# EAGLE design cnn_card (EAGLE 9.7.0)
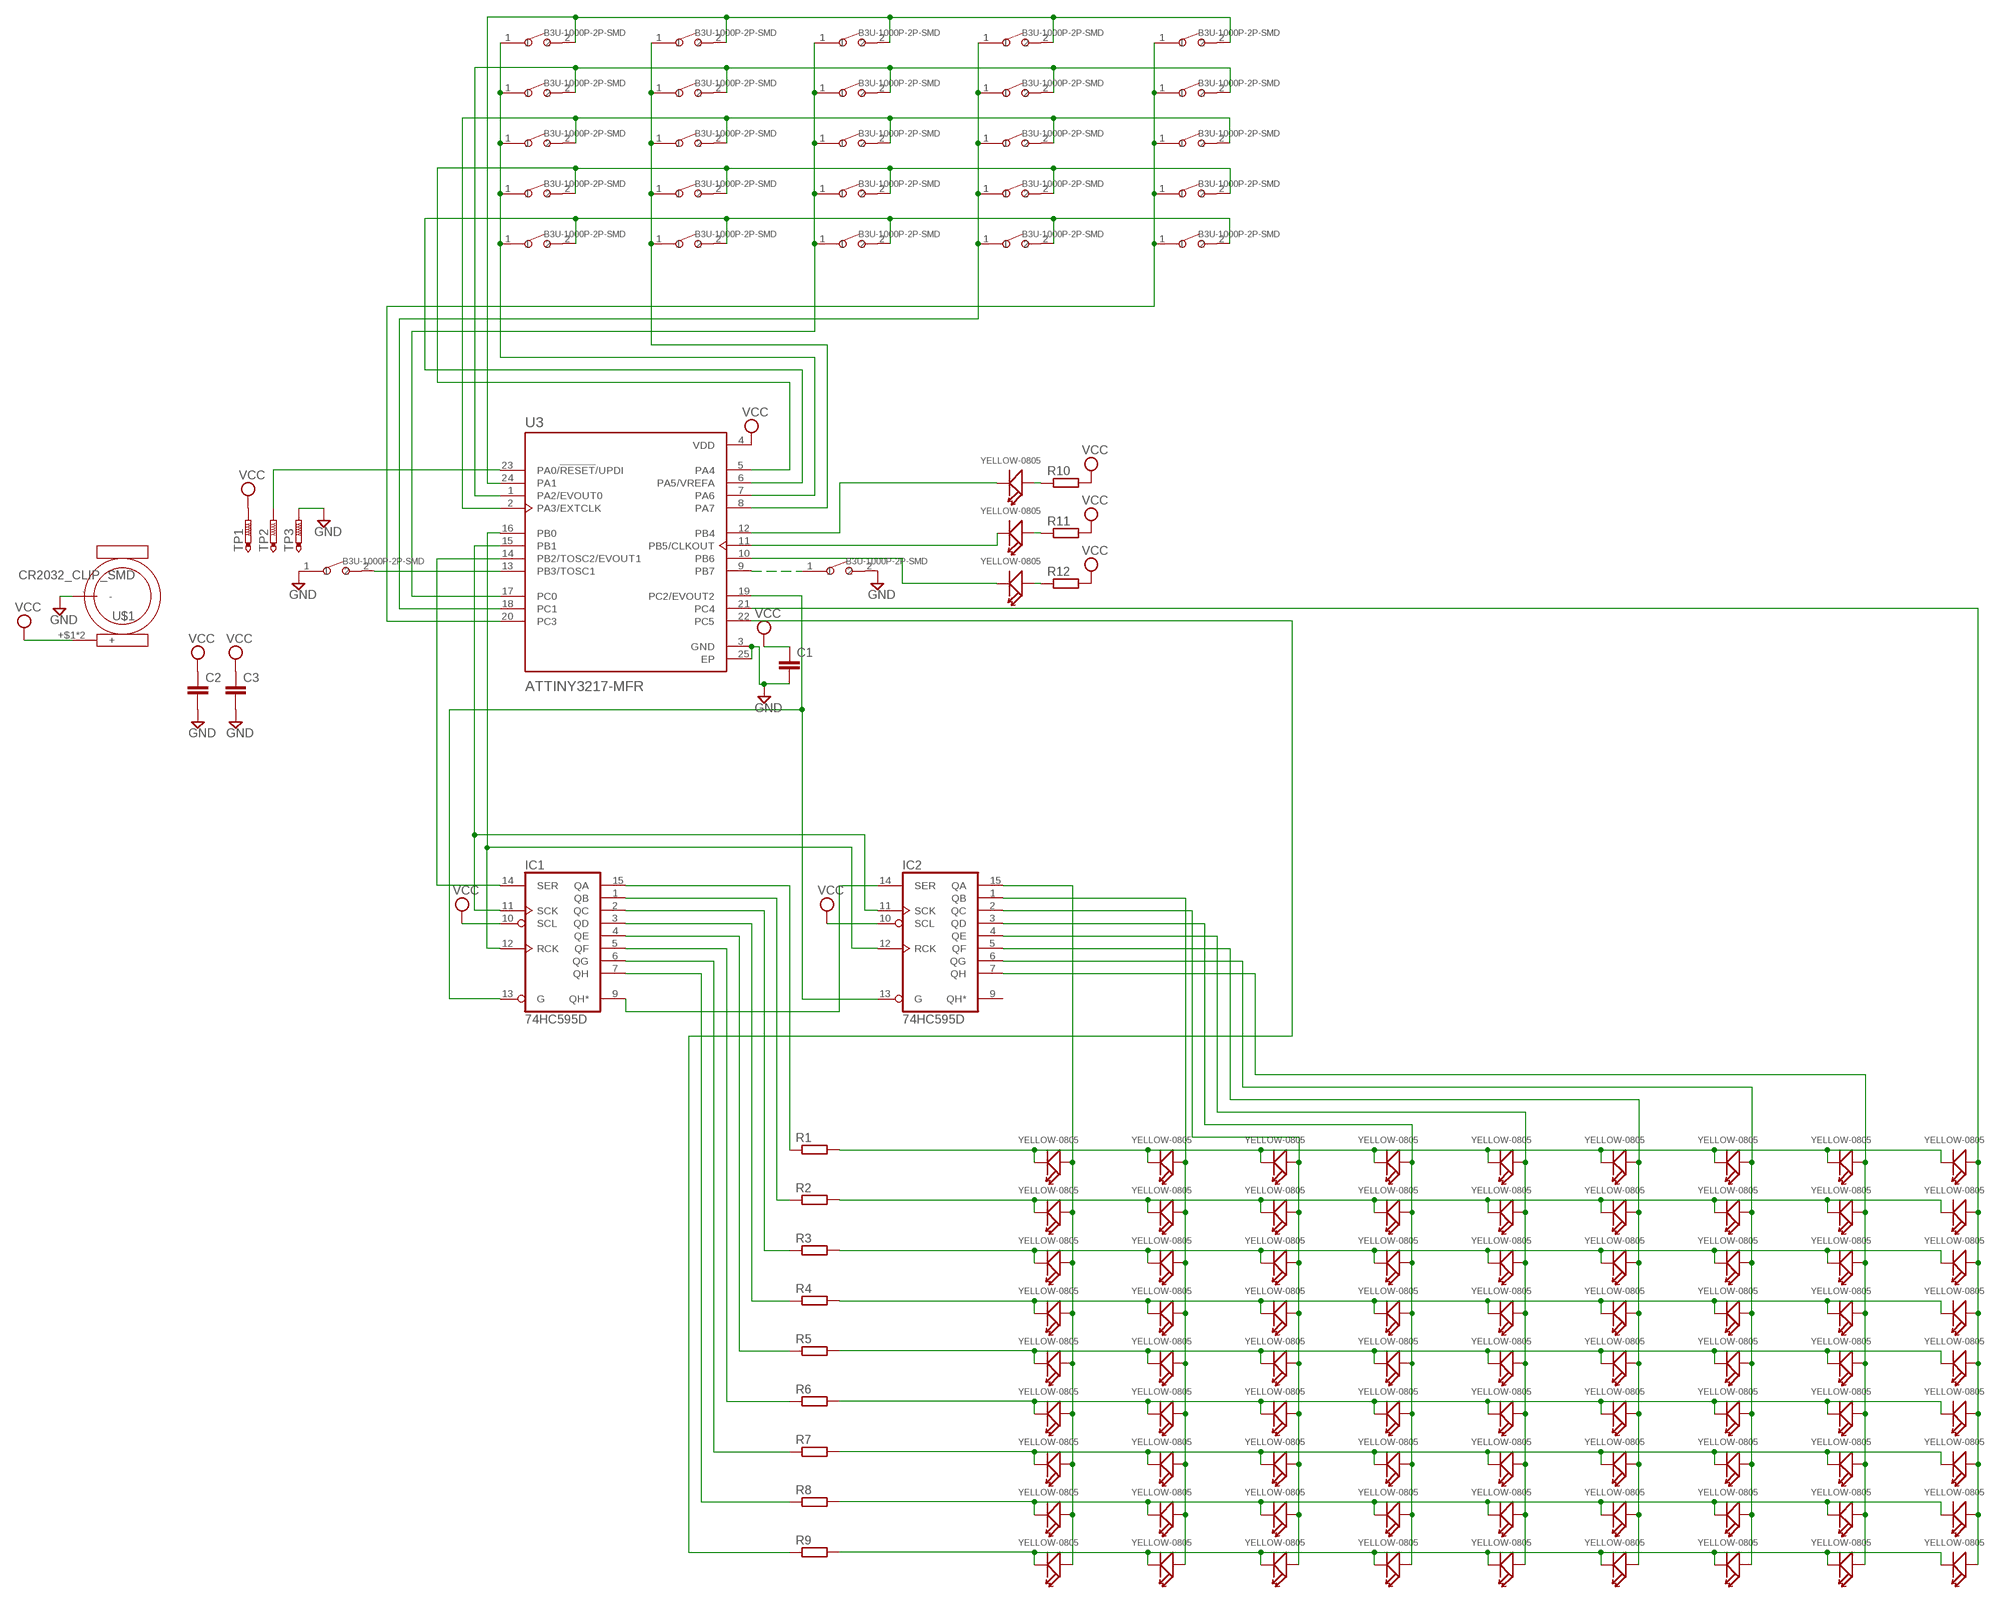
[diagram p0: schematic, sheet 1]

## Parts
C1  C-EUC0805  [C0805]
C2  C-EUC0805  [C0805]
C3  C-EUC0805  [C0805]
D1  YELLOW-0805  SMD-LED-CLEAR-YELLOW(0805)  [LED-0805]
D2  YELLOW-0805  SMD-LED-CLEAR-YELLOW(0805)  [LED-0805]
D3  YELLOW-0805  SMD-LED-CLEAR-YELLOW(0805)  [LED-0805]
D4  YELLOW-0805  SMD-LED-CLEAR-YELLOW(0805)  [LED-0805]
D5  YELLOW-0805  SMD-LED-CLEAR-YELLOW(0805)  [LED-0805]
D6  YELLOW-0805  SMD-LED-CLEAR-YELLOW(0805)  [LED-0805]
D7  YELLOW-0805  SMD-LED-CLEAR-YELLOW(0805)  [LED-0805]
D8  YELLOW-0805  SMD-LED-CLEAR-YELLOW(0805)  [LED-0805]
D9  YELLOW-0805  SMD-LED-CLEAR-YELLOW(0805)  [LED-0805]
D10  YELLOW-0805  SMD-LED-CLEAR-YELLOW(0805)  [LED-0805]
D11  YELLOW-0805  SMD-LED-CLEAR-YELLOW(0805)  [LED-0805]
D12  YELLOW-0805  SMD-LED-CLEAR-YELLOW(0805)  [LED-0805]
D13  YELLOW-0805  SMD-LED-CLEAR-YELLOW(0805)  [LED-0805]
D14  YELLOW-0805  SMD-LED-CLEAR-YELLOW(0805)  [LED-0805]
D15  YELLOW-0805  SMD-LED-CLEAR-YELLOW(0805)  [LED-0805]
D16  YELLOW-0805  SMD-LED-CLEAR-YELLOW(0805)  [LED-0805]
D17  YELLOW-0805  SMD-LED-CLEAR-YELLOW(0805)  [LED-0805]
D18  YELLOW-0805  SMD-LED-CLEAR-YELLOW(0805)  [LED-0805]
D19  YELLOW-0805  SMD-LED-CLEAR-YELLOW(0805)  [LED-0805]
D20  YELLOW-0805  SMD-LED-CLEAR-YELLOW(0805)  [LED-0805]
D21  YELLOW-0805  SMD-LED-CLEAR-YELLOW(0805)  [LED-0805]
D22  YELLOW-0805  SMD-LED-CLEAR-YELLOW(0805)  [LED-0805]
D23  YELLOW-0805  SMD-LED-CLEAR-YELLOW(0805)  [LED-0805]
D24  YELLOW-0805  SMD-LED-CLEAR-YELLOW(0805)  [LED-0805]
D25  YELLOW-0805  SMD-LED-CLEAR-YELLOW(0805)  [LED-0805]
D26  YELLOW-0805  SMD-LED-CLEAR-YELLOW(0805)  [LED-0805]
D27  YELLOW-0805  SMD-LED-CLEAR-YELLOW(0805)  [LED-0805]
D28  YELLOW-0805  SMD-LED-CLEAR-YELLOW(0805)  [LED-0805]
D29  YELLOW-0805  SMD-LED-CLEAR-YELLOW(0805)  [LED-0805]
D30  YELLOW-0805  SMD-LED-CLEAR-YELLOW(0805)  [LED-0805]
D31  YELLOW-0805  SMD-LED-CLEAR-YELLOW(0805)  [LED-0805]
D32  YELLOW-0805  SMD-LED-CLEAR-YELLOW(0805)  [LED-0805]
D33  YELLOW-0805  SMD-LED-CLEAR-YELLOW(0805)  [LED-0805]
D34  YELLOW-0805  SMD-LED-CLEAR-YELLOW(0805)  [LED-0805]
D35  YELLOW-0805  SMD-LED-CLEAR-YELLOW(0805)  [LED-0805]
D36  YELLOW-0805  SMD-LED-CLEAR-YELLOW(0805)  [LED-0805]
D37  YELLOW-0805  SMD-LED-CLEAR-YELLOW(0805)  [LED-0805]
D38  YELLOW-0805  SMD-LED-CLEAR-YELLOW(0805)  [LED-0805]
D39  YELLOW-0805  SMD-LED-CLEAR-YELLOW(0805)  [LED-0805]
D40  YELLOW-0805  SMD-LED-CLEAR-YELLOW(0805)  [LED-0805]
D41  YELLOW-0805  SMD-LED-CLEAR-YELLOW(0805)  [LED-0805]
D42  YELLOW-0805  SMD-LED-CLEAR-YELLOW(0805)  [LED-0805]
D43  YELLOW-0805  SMD-LED-CLEAR-YELLOW(0805)  [LED-0805]
D44  YELLOW-0805  SMD-LED-CLEAR-YELLOW(0805)  [LED-0805]
D45  YELLOW-0805  SMD-LED-CLEAR-YELLOW(0805)  [LED-0805]
D46  YELLOW-0805  SMD-LED-CLEAR-YELLOW(0805)  [LED-0805]
D47  YELLOW-0805  SMD-LED-CLEAR-YELLOW(0805)  [LED-0805]
D48  YELLOW-0805  SMD-LED-CLEAR-YELLOW(0805)  [LED-0805]
D49  YELLOW-0805  SMD-LED-CLEAR-YELLOW(0805)  [LED-0805]
D50  YELLOW-0805  SMD-LED-CLEAR-YELLOW(0805)  [LED-0805]
D51  YELLOW-0805  SMD-LED-CLEAR-YELLOW(0805)  [LED-0805]
D52  YELLOW-0805  SMD-LED-CLEAR-YELLOW(0805)  [LED-0805]
D53  YELLOW-0805  SMD-LED-CLEAR-YELLOW(0805)  [LED-0805]
D54  YELLOW-0805  SMD-LED-CLEAR-YELLOW(0805)  [LED-0805]
D55  YELLOW-0805  SMD-LED-CLEAR-YELLOW(0805)  [LED-0805]
D56  YELLOW-0805  SMD-LED-CLEAR-YELLOW(0805)  [LED-0805]
D57  YELLOW-0805  SMD-LED-CLEAR-YELLOW(0805)  [LED-0805]
D61  YELLOW-0805  SMD-LED-CLEAR-YELLOW(0805)  [LED-0805]
D62  YELLOW-0805  SMD-LED-CLEAR-YELLOW(0805)  [LED-0805]
D63  YELLOW-0805  SMD-LED-CLEAR-YELLOW(0805)  [LED-0805]
D64  YELLOW-0805  SMD-LED-CLEAR-YELLOW(0805)  [LED-0805]
D65  YELLOW-0805  SMD-LED-CLEAR-YELLOW(0805)  [LED-0805]
D66  YELLOW-0805  SMD-LED-CLEAR-YELLOW(0805)  [LED-0805]
D67  YELLOW-0805  SMD-LED-CLEAR-YELLOW(0805)  [LED-0805]
D68  YELLOW-0805  SMD-LED-CLEAR-YELLOW(0805)  [LED-0805]
D69  YELLOW-0805  SMD-LED-CLEAR-YELLOW(0805)  [LED-0805]
D71  YELLOW-0805  SMD-LED-CLEAR-YELLOW(0805)  [LED-0805]
D72  YELLOW-0805  SMD-LED-CLEAR-YELLOW(0805)  [LED-0805]
D73  YELLOW-0805  SMD-LED-CLEAR-YELLOW(0805)  [LED-0805]
D74  YELLOW-0805  SMD-LED-CLEAR-YELLOW(0805)  [LED-0805]
D75  YELLOW-0805  SMD-LED-CLEAR-YELLOW(0805)  [LED-0805]
D76  YELLOW-0805  SMD-LED-CLEAR-YELLOW(0805)  [LED-0805]
D77  YELLOW-0805  SMD-LED-CLEAR-YELLOW(0805)  [LED-0805]
D78  YELLOW-0805  SMD-LED-CLEAR-YELLOW(0805)  [LED-0805]
D79  YELLOW-0805  SMD-LED-CLEAR-YELLOW(0805)  [LED-0805]
D81  YELLOW-0805  SMD-LED-CLEAR-YELLOW(0805)  [LED-0805]
D82  YELLOW-0805  SMD-LED-CLEAR-YELLOW(0805)  [LED-0805]
D83  YELLOW-0805  SMD-LED-CLEAR-YELLOW(0805)  [LED-0805]
D84  YELLOW-0805  SMD-LED-CLEAR-YELLOW(0805)  [LED-0805]
D85  YELLOW-0805  SMD-LED-CLEAR-YELLOW(0805)  [LED-0805]
D86  YELLOW-0805  SMD-LED-CLEAR-YELLOW(0805)  [LED-0805]
D87  YELLOW-0805  SMD-LED-CLEAR-YELLOW(0805)  [LED-0805]
D88  YELLOW-0805  SMD-LED-CLEAR-YELLOW(0805)  [LED-0805]
D89  YELLOW-0805  SMD-LED-CLEAR-YELLOW(0805)  [LED-0805]
FILTER_SW  B3U-1000P-2P-SMD  SMD-BUTTON(2P-3.0X2.5X1.2+0.4MM)-B3U-1000P-2P-SMD  [SW2-2.6-3.0X2.5X1.2+0.4MM]
IC1  74HC595D  [SO16]
IC2  74HC595D  [SO16]
PWR_SW  B3U-1000P-2P-SMD  SMD-BUTTON(2P-3.0X2.5X1.2+0.4MM)-B3U-1000P-2P-SMD  [SW2-2.6-3.0X2.5X1.2+0.4MM]
R1  R-EU_R0805  [R0805]
R2  R-EU_R0805  [R0805]
R3  R-EU_R0805  [R0805]
R4  R-EU_R0805  [R0805]
R5  R-EU_R0805  [R0805]
R6  R-EU_R0805  [R0805]
R7  R-EU_R0805  [R0805]
R8  R-EU_R0805  [R0805]
R9  R-EU_R0805  [R0805]
R10  R-EU_R0805  [R0805]
R11  R-EU_R0805  [R0805]
R12  R-EU_R0805  [R0805]
SW1  B3U-1000P-2P-SMD  SMD-BUTTON(2P-3.0X2.5X1.2+0.4MM)-B3U-1000P-2P-SMD  [SW2-2.6-3.0X2.5X1.2+0.4MM]
SW2  B3U-1000P-2P-SMD  SMD-BUTTON(2P-3.0X2.5X1.2+0.4MM)-B3U-1000P-2P-SMD  [SW2-2.6-3.0X2.5X1.2+0.4MM]
SW3  B3U-1000P-2P-SMD  SMD-BUTTON(2P-3.0X2.5X1.2+0.4MM)-B3U-1000P-2P-SMD  [SW2-2.6-3.0X2.5X1.2+0.4MM]
SW4  B3U-1000P-2P-SMD  SMD-BUTTON(2P-3.0X2.5X1.2+0.4MM)-B3U-1000P-2P-SMD  [SW2-2.6-3.0X2.5X1.2+0.4MM]
SW5  B3U-1000P-2P-SMD  SMD-BUTTON(2P-3.0X2.5X1.2+0.4MM)-B3U-1000P-2P-SMD  [SW2-2.6-3.0X2.5X1.2+0.4MM]
SW6  B3U-1000P-2P-SMD  SMD-BUTTON(2P-3.0X2.5X1.2+0.4MM)-B3U-1000P-2P-SMD  [SW2-2.6-3.0X2.5X1.2+0.4MM]
SW7  B3U-1000P-2P-SMD  SMD-BUTTON(2P-3.0X2.5X1.2+0.4MM)-B3U-1000P-2P-SMD  [SW2-2.6-3.0X2.5X1.2+0.4MM]
SW8  B3U-1000P-2P-SMD  SMD-BUTTON(2P-3.0X2.5X1.2+0.4MM)-B3U-1000P-2P-SMD  [SW2-2.6-3.0X2.5X1.2+0.4MM]
SW9  B3U-1000P-2P-SMD  SMD-BUTTON(2P-3.0X2.5X1.2+0.4MM)-B3U-1000P-2P-SMD  [SW2-2.6-3.0X2.5X1.2+0.4MM]
SW10  B3U-1000P-2P-SMD  SMD-BUTTON(2P-3.0X2.5X1.2+0.4MM)-B3U-1000P-2P-SMD  [SW2-2.6-3.0X2.5X1.2+0.4MM]
SW11  B3U-1000P-2P-SMD  SMD-BUTTON(2P-3.0X2.5X1.2+0.4MM)-B3U-1000P-2P-SMD  [SW2-2.6-3.0X2.5X1.2+0.4MM]
SW12  B3U-1000P-2P-SMD  SMD-BUTTON(2P-3.0X2.5X1.2+0.4MM)-B3U-1000P-2P-SMD  [SW2-2.6-3.0X2.5X1.2+0.4MM]
SW13  B3U-1000P-2P-SMD  SMD-BUTTON(2P-3.0X2.5X1.2+0.4MM)-B3U-1000P-2P-SMD  [SW2-2.6-3.0X2.5X1.2+0.4MM]
SW14  B3U-1000P-2P-SMD  SMD-BUTTON(2P-3.0X2.5X1.2+0.4MM)-B3U-1000P-2P-SMD  [SW2-2.6-3.0X2.5X1.2+0.4MM]
SW15  B3U-1000P-2P-SMD  SMD-BUTTON(2P-3.0X2.5X1.2+0.4MM)-B3U-1000P-2P-SMD  [SW2-2.6-3.0X2.5X1.2+0.4MM]
SW16  B3U-1000P-2P-SMD  SMD-BUTTON(2P-3.0X2.5X1.2+0.4MM)-B3U-1000P-2P-SMD  [SW2-2.6-3.0X2.5X1.2+0.4MM]
SW17  B3U-1000P-2P-SMD  SMD-BUTTON(2P-3.0X2.5X1.2+0.4MM)-B3U-1000P-2P-SMD  [SW2-2.6-3.0X2.5X1.2+0.4MM]
SW18  B3U-1000P-2P-SMD  SMD-BUTTON(2P-3.0X2.5X1.2+0.4MM)-B3U-1000P-2P-SMD  [SW2-2.6-3.0X2.5X1.2+0.4MM]
SW19  B3U-1000P-2P-SMD  SMD-BUTTON(2P-3.0X2.5X1.2+0.4MM)-B3U-1000P-2P-SMD  [SW2-2.6-3.0X2.5X1.2+0.4MM]
SW20  B3U-1000P-2P-SMD  SMD-BUTTON(2P-3.0X2.5X1.2+0.4MM)-B3U-1000P-2P-SMD  [SW2-2.6-3.0X2.5X1.2+0.4MM]
SW21  B3U-1000P-2P-SMD  SMD-BUTTON(2P-3.0X2.5X1.2+0.4MM)-B3U-1000P-2P-SMD  [SW2-2.6-3.0X2.5X1.2+0.4MM]
SW22  B3U-1000P-2P-SMD  SMD-BUTTON(2P-3.0X2.5X1.2+0.4MM)-B3U-1000P-2P-SMD  [SW2-2.6-3.0X2.5X1.2+0.4MM]
SW23  B3U-1000P-2P-SMD  SMD-BUTTON(2P-3.0X2.5X1.2+0.4MM)-B3U-1000P-2P-SMD  [SW2-2.6-3.0X2.5X1.2+0.4MM]
SW24  B3U-1000P-2P-SMD  SMD-BUTTON(2P-3.0X2.5X1.2+0.4MM)-B3U-1000P-2P-SMD  [SW2-2.6-3.0X2.5X1.2+0.4MM]
SW25  B3U-1000P-2P-SMD  SMD-BUTTON(2P-3.0X2.5X1.2+0.4MM)-B3U-1000P-2P-SMD  [SW2-2.6-3.0X2.5X1.2+0.4MM]
TP1  PTR1TP15R  [TP15R]
TP2  PTR1TP15R  [TP15R]
TP3  PTR1TP15R  [TP15R]
U3  ATTINY3217-MFR  [QFN50P400X400X90-25N]
U$1  CR2032_CLIP_SMD  [CR2032_SMT_BAT-HLD-001]

## Nets
GND: C1.2 C2.2 C3.2 FILTER_SW.2 PWR_SW.1 TP3.TP U3.3(GND) U3.25(EP) U$1.-
N$1: D55.- U3.12(PB4)
N$2: D56.- U3.11(PB5/CLKOUT)
N$3: D57.- U3.10(PB6)
N$4: D55.+ R10.1
N$5: D56.+ R11.1
N$6: D57.+ R12.1
N$7: IC1.12(RCK) IC2.12(RCK) U3.16(PB0)
N$10: TP2.TP U3.23(PA0/!RESET!/UPDI)
N$11: IC1.15(QA) R1.1
N$13: IC1.1(QB) R2.1
N$14: IC1.2(QC) R3.1
N$16: IC1.3(QD) R4.1
N$17: IC1.4(QE) R5.1
N$18: FILTER_SW.1 U3.9(PB7)
N$67: IC1.5(QF) R6.1
N$68: IC1.6(QG) R7.1
N$69: IC1.7(QH) R8.1
N$70: R9.1 U3.22(PC5)
N$72: PWR_SW.2 U3.13(PB3/TOSC1)
N$73: IC1.13(G) IC2.13(G) U3.19(PC2/EVOUT2)
N$97: SW1.1 SW2.1 SW3.1 SW4.1 SW5.1 U3.7(PA6)
N$98: SW6.1 SW7.1 SW8.1 SW9.1 SW10.1 U3.8(PA7)
N$99: SW11.1 SW12.1 SW13.1 SW14.1 SW15.1 U3.17(PC0)
N$100: SW16.1 SW17.1 SW18.1 SW19.1 SW20.1 U3.18(PC1)
N$101: SW21.1 SW22.1 SW23.1 SW24.1 SW25.1 U3.20(PC3)
N$102: SW1.2 SW6.2 SW11.2 SW16.2 SW21.2 U3.24(PA1)
N$103: SW2.2 SW7.2 SW12.2 SW17.2 SW22.2 U3.1(PA2/EVOUT0)
N$104: SW3.2 SW8.2 SW13.2 SW18.2 SW23.2 U3.2(PA3/EXTCLK)
N$105: SW4.2 SW9.2 SW14.2 SW19.2 SW24.2 U3.5(PA4)
N$106: SW5.2 SW10.2 SW15.2 SW20.2 SW25.2 U3.6(PA5/VREFA)
N$110: IC1.9(QH*) IC2.14(SER)
N$118: IC1.14(SER) U3.14(PB2/TOSC2/EVOUT1)
N$119: IC1.11(SCK) IC2.11(SCK) U3.15(PB1)
N$LC1: D1.+ D2.+ D3.+ D4.+ D5.+ D41.+ D61.+ D71.+ D81.+ IC2.15(QA)
N$LC2: D6.+ D7.+ D8.+ D9.+ D10.+ D42.+ D62.+ D72.+ D82.+ IC2.1(QB)
N$LC3: D11.+ D12.+ D13.+ D14.+ D15.+ D43.+ D63.+ D73.+ D83.+ IC2.2(QC)
N$LC4: D16.+ D17.+ D18.+ D19.+ D20.+ D44.+ D64.+ D74.+ D84.+ IC2.3(QD)
N$LC5: D21.+ D22.+ D23.+ D24.+ D25.+ D45.+ D65.+ D75.+ D85.+ IC2.4(QE)
N$LC6: D26.+ D27.+ D28.+ D29.+ D30.+ D46.+ D66.+ D76.+ D86.+ IC2.5(QF)
N$LC7: D31.+ D32.+ D33.+ D34.+ D35.+ D47.+ D67.+ D77.+ D87.+ IC2.6(QG)
N$LC8: D36.+ D37.+ D38.+ D39.+ D40.+ D48.+ D68.+ D78.+ D88.+ IC2.7(QH)
N$LC9: D49.+ D50.+ D51.+ D52.+ D53.+ D54.+ D69.+ D79.+ D89.+ U3.21(PC4)
N$LR1: D1.- D6.- D11.- D16.- D21.- D26.- D31.- D36.- D49.- R1.2
N$LR2: D2.- D7.- D12.- D17.- D22.- D27.- D32.- D37.- D50.- R2.2
N$LR3: D3.- D8.- D13.- D18.- D23.- D28.- D33.- D38.- D51.- R3.2
N$LR4: D4.- D9.- D14.- D19.- D24.- D29.- D34.- D39.- D52.- R4.2
N$LR5: D5.- D10.- D15.- D20.- D25.- D30.- D35.- D40.- D53.- R5.2
N$LR6: D41.- D42.- D43.- D44.- D45.- D46.- D47.- D48.- D54.- R6.2
N$LR7: D61.- D62.- D63.- D64.- D65.- D66.- D67.- D68.- D69.- R7.2
N$LR8: D71.- D72.- D73.- D74.- D75.- D76.- D77.- D78.- D79.- R8.2
N$LR9: D81.- D82.- D83.- D84.- D85.- D86.- D87.- D88.- D89.- R9.2
VCC: C1.1 C2.1 C3.1 IC1.10(SCL) IC2.10(SCL) R10.2 R11.2 R12.2 TP1.TP U3.4(VDD) U$1.+$1(+) U$1.+$2(+)
Unconnected: IC2.9(QH*)

## Power pins joined to a net without a drawn wire
GND: IC1.8(GND) IC2.8(GND)
VCC: IC1.16(VCC) IC2.16(VCC)

## Library data of the parts
C1-C3 = rcl:C-EU: CAPACITOR, European symbol; SPICEPREFIX: C
D1-D57 D61-D69 D71-D79 D81-D89 = OPL_Optoelectronics_arrow_tvalues:SMD-LED-CLEAR-YELLOW(0805): 304090039; MPN: 17-215UYC/S530-A3/TR8
FILTER_SW PWR_SW SW1-SW25 = OPL_Switch_larger_pads:SMD-BUTTON(2P-3.0X2.5X1.2+0.4MM): 311020047; MPN: B3U-1000P-2P-SMD
IC1 IC2 = 74xx-eu:74*595: 8-bit SHIFT REGISTER, output latch
R1-R12 = rcl:R-EU_: RESISTOR, European symbol; SPICEPREFIX: R
TP1-TP3 = testpad:PTR1: TEST PIN
U3 = ATTINY3217-MFR:ATTINY3217-MFR: 20MHZ, 32KB, QFN24, Ind 125C, Green, T&r; AVAILABILITY: Unavailable; DESCRIPTION: 20MHZ, 32KB, QFN24, Ind 125C, Green, T&r; MF: Microchip; MP: ATTINY3217-MFR; PACKAGE: VFQFN-24 Microchip; PRICE: None
U$1 = CR2032_CLIP:CR2032_CLIP_SMD

## Board
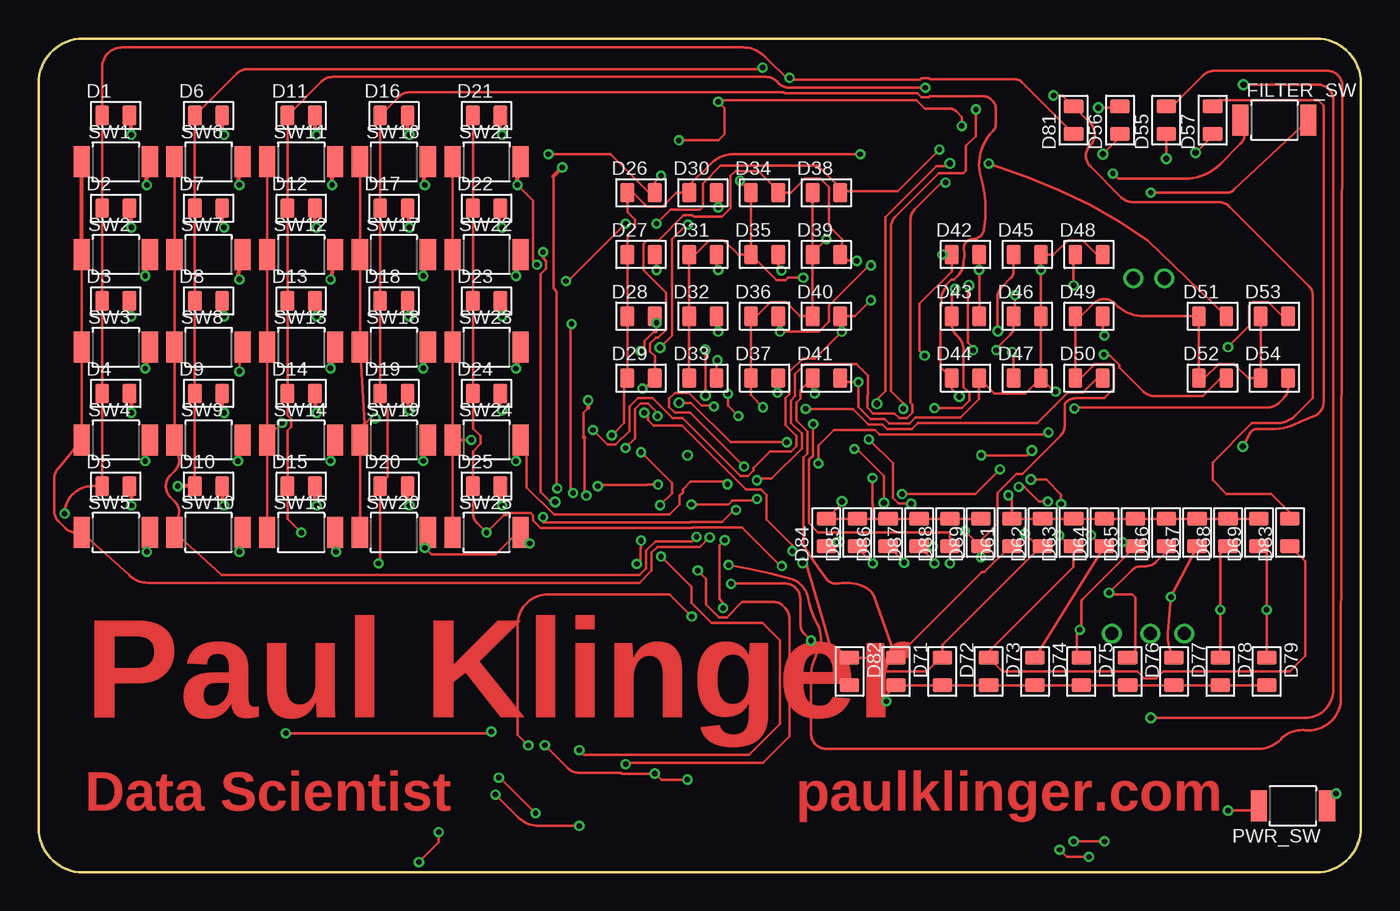
[diagram p1: board, top side]
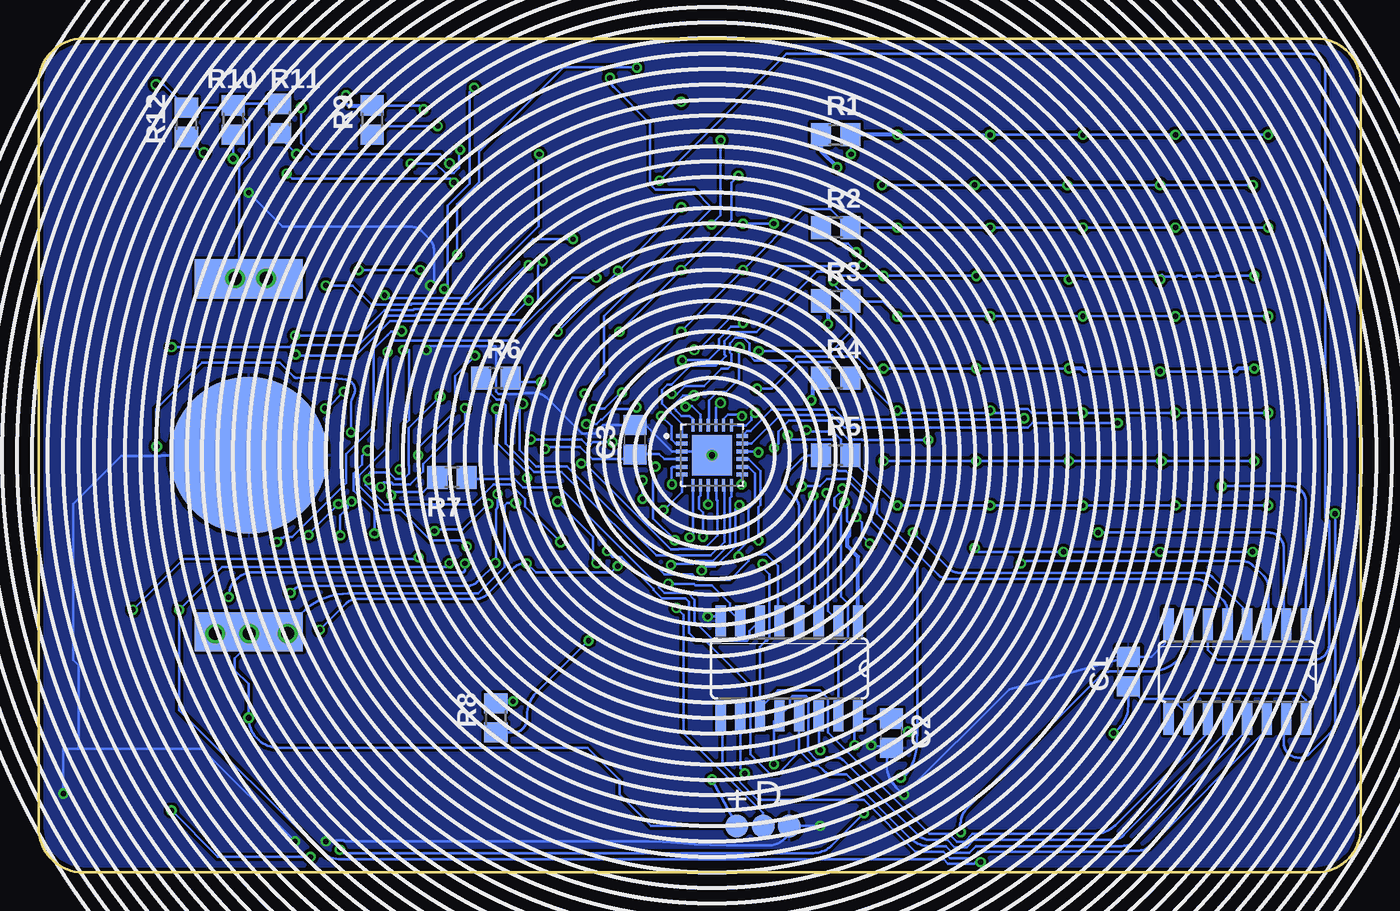
[diagram p2: board, bottom side, seen from below]

Size 85.6 x 53.98 mm. Coordinates in mm from the lower left corner, seen from the top.
Outline: 2.88,53.98 arc90 0,51.1 0,2.88 arc90 2.88,0 82.72,0 arc90 85.6,2.88 85.6,51.1 arc90 82.72,53.98 2.88,53.98
Copper layers (1*16): Top 0.035mm / dielectric 1.5mm / Bottom 0.035mm
Design rules "dirt_cheap_dirty_boards.v1.1 *": minimum track width 6mil, minimum drill 12mil, track to track 8mil, track to pad 8mil, pad to pad 6mil, via to via 8mil, smd to smd 0mil, copper to edge 10mil, drill to drill 10mil, minimum pad ring 10mil, minimum via ring 6mil, stop-mask expansion 2mil, vias tented up to drill 25mil, thermal gap 10mil

### Footprints (pad centres in the part's own frame; a part is rotated, then mirrored left to right if it is on the bottom)
C0805 = smd 1.3 x 1.5: 1 -0.95,0; 2 0.95,0
LED-0805 = smd 0.889 x 1.27: + -0.889,0; - 0.889,0
SW2-2.6-3.0X2.5X1.2+0.4MM = smd 1.05 x 2: 1 -2.203,0; 2 2.203,0
SO16 = smd 0.66 x 2.032: 1 -4.445,-3.073; 2 -3.175,-3.073; 3 -1.905,-3.073; 4 -0.635,-3.073; 5 0.635,-3.073; 6 1.905,-3.073; 7 3.175,-3.073; 8 4.445,-3.073; 9 4.445,3.073; 10 3.175,3.073; 11 1.905,3.073; 12 0.635,3.073; 13 -0.635,3.073; 14 -1.905,3.073; 15 -3.175,3.073; 16 -4.445,3.073
R0805 = smd 1.3 x 1.5: 1 -0.95,0; 2 0.95,0
TP15R = smd 1.5 x 1.5: TP 0,0
QFN50P400X400X90-25N = smd 0.81 x 0.26: 1 -1.95,1.25; 2 -1.95,0.75; 3 -1.95,0.25; 4 -1.95,-0.25; 5 -1.95,-0.75; 6 -1.95,-1.25; 13 1.95,-1.25; 14 1.95,-0.75; 15 1.95,-0.25; 16 1.95,0.25; 17 1.95,0.75; 18 1.95,1.25 | smd 0.26 x 0.81: 7 -1.25,-1.95; 8 -0.75,-1.95; 9 -0.25,-1.95; 10 0.25,-1.95; 11 0.75,-1.95; 12 1.25,-1.95; 19 1.25,1.95; 20 0.75,1.95; 21 0.25,1.95; 22 -0.25,1.95; 23 -0.75,1.95; 24 -1.25,1.95 | smd 2.6 x 2.6: 25 0,0
CR2032_SMT_BAT-HLD-001 = smd 2.54 x 7: +$1 -11.43,0; +$2 11.43,0 | smd 10.16 x 10.16: - 0,0

### Placement (x,y rotation side)
C1  15.06,12.99 90 bottom
C2  30.4,9 270 bottom
C3  47,28 90 bottom
D1  5,49 0 top
D2  5,43 0 top
D3  5,37 0 top
D4  5,31 0 top
D5  5,25 0 top
D6  11,49 0 top
D7  11,43 0 top
D8  11,37 0 top
D9  11,31 0 top
D10  11,25 0 top
D11  17,49 0 top
D12  17,43 0 top
D13  17,37 0 top
D14  17,31 0 top
D15  17,25 0 top
D16  23,49 0 top
D17  23,43 0 top
D18  23,37 0 top
D19  23,31 0 top
D20  23,25 0 top
D21  29,49 0 top
D22  29,43 0 top
D23  29,37 0 top
D24  29,31 0 top
D25  29,25 0 top
D26  39,44 0 top
D27  39,40 0 top
D28  39,36 0 top
D29  39,32 0 top
D30  43,44 0 top
D31  43,40 0 top
D32  43,36 0 top
D33  43,32 0 top
D34  47,44 0 top
D35  47,40 0 top
D36  47,36 0 top
D37  47,32 0 top
D38  51,44 0 top
D39  51,40 0 top
D40  51,36 0 top
D41  51,32 0 top
D42  60,40 0 top
D43  60,36 0 top
D44  60,32 0 top
D45  64,40 0 top
D46  64,36 0 top
D47  64,32 0 top
D48  68,40 0 top
D49  68,36 0 top
D50  68,32 0 top
D51  76,36 0 top
D52  76,32 0 top
D53  80,36 0 top
D54  80,32 0 top
D55  73,48.7 90 top
D56  70,48.7 90 top
D57  76,48.7 90 top
D61  63,22 90 top
D62  65,22 90 top
D63  67,22 90 top
D64  69,22 90 top
D65  71,22 90 top
D66  73,22 90 top
D67  75,22 90 top
D68  77,22 90 top
D69  79,22 90 top
D71  55.5,13 270 top
D72  58.5,13 270 top
D73  61.5,13 270 top
D74  64.5,13 270 top
D75  67.5,13 270 top
D76  70.5,13 270 top
D77  73.5,13 270 top
D78  76.5,13 270 top
D79  79.5,13 270 top
D81  67,48.7 90 top
D82  52.5,13 270 top
D83  81,22 90 top
D84  51,22 90 top
D85  53,22 90 top
D86  55,22 90 top
D87  57,22 90 top
D88  59,22 90 top
D89  61,22 90 top
FILTER_SW  80,48.7 0 top
IC1  37,13.2 180 bottom
IC2  8,13 180 bottom
PWR_SW  81.2,4.3 180 top
R1  34,47.75 0 bottom
R2  34,41.75 0 bottom
R3  34,37 0 bottom
R4  34,32 0 bottom
R5  34,27 0 bottom
R6  56,32 0 bottom
R7  58.84,25.57 180 bottom
R8  56,10 90 bottom
R9  64,48.7 90 bottom
R10  73,48.7 90 bottom
R11  70,48.8 90 bottom
R12  76.03,48.56 90 bottom
SW1  5,46 0 top
SW2  5,40 0 top
SW3  5,34 0 top
SW4  5,28 0 top
SW5  5,22 0 top
SW6  11,46 0 top
SW7  11,40 0 top
SW8  11,34 0 top
SW9  11,28 0 top
SW10  11,22 0 top
SW11  17,46 0 top
SW12  17,40 0 top
SW13  17,34 0 top
SW14  17,28 0 top
SW15  17,22 0 top
SW16  23,46 0 top
SW17  23,40 0 top
SW18  23,34 0 top
SW19  23,28 0 top
SW20  23,22 0 top
SW21  29,46 0 top
SW22  29,40 0 top
SW23  29,34 0 top
SW24  29,28 0 top
SW25  29,22 0 top
TP1  40.4,3 90 bottom
TP2  38.7,3 90 bottom
TP3  37,3 90 bottom
U3  42,27 0 bottom
U$1  72,27 270 bottom

### Tracks (layer width: path | path; a pad name or v marks a point on that pad's centre or on a via)
GND  (via drill 0.35, 0.4)
  Top 0.152: v84,5.1 83.1,5.1 PWR_SW.1 | v35,3 32.41,3 arc-45 31.02,3.58 v29.57,5.03 | v31.7,8.21 31,8.91 31,16 arc-90 33,18 40.84,18 v42.28,16.56 | v69,2 v67,2 | FILTER_SW.2 77.39,44.19 arc-45 76.94,44 v72.01,44 v72,44.01 | v60.22,38 60.16,37.94 60.16,34.29 60.49,33.96 v60.49,33.81
  Bottom 0.152: v84,5.1 84,8 83,8 | IC2.8 12.45,15.07 13.57,13.94 C1.2 22.76,11.84 29.6,5 | v35,3 TP3.TP arc90 38.25,1.75 41.05,1.75 arc5 44.2,1.9 arc-7 47.1,2 65.78,2 65.84,2.07 66.35,2.07 66.41,2 v67,2 | v31.7,8.21 30.44,8.09 C2.2 arc-75 30.07,5.47 29.6,5 | U3.25 42.25,27.25 U3.3 44.6,27.25 46.3,28.95 C3.2 49.05,28.95 49.59,28.41 50.41,28.41 52.73,30.73 arc-45 53.44,31.02 54.23,31.02 54.28,30.97 55.82,30.97 55.98,31.13 55.98,33.98 56.06,34.06 60.39,34.06 60.49,33.96 v60.49,33.81 | v69,2 75,8 83,8 | 83,8 83,13.39 83.35,13.74 83.35,23.85 80.26,26.94 77.7,26.94 77.64,27 U$1.- | IC1.8 41.73,16.56 v42.28,16.56 | v60.22,38 60,38.22 60,40.29 arc-45 60.29,40.99 60.81,41.51 arc-45 61.51,41.8 69.79,41.8 v72,44.01 | 29.6,5 v29.57,5.03
  other vias: 42,27
  pour Bottom: -6,61 -6,-6 90,-6 90,61
N$1  (via drill 0.35)
  Top 0.152: D55.- 73.39,49.59 75.41,51.61 arc-45 76.11,51.9 83.4,51.9 arc-90 84.4,50.9 84.3,10.9 arc-84 82,9.2 arc52 80.4,8.6 arc-46 79,8 51,8 arc-90 50,9 50,12.59 arc-28 50.4,14.2 arc56 50.4,16.1 arc-17 49.8,17.8 arc63 48.71,19 arc8 v44.67,19.89
  Bottom 0.152: U3.12 40.74,24.35 40.84,24.25 40.84,21.25 41.95,20.14 43.05,20.14 43.25,19.95 44.67,19.95 v44.67,19.89
N$2  (via drill 0.4)
  Top 0.152: v68.6,49.5 69.91,49.5 D56.- | v54.27,30.34 54.27,30.61 54.81,31.15 54.81,42.42 58.12,45.72 58.72,45.72 58.9,45.9 v59,45.9
  Bottom 0.152: v59,45.9 59.6,46.5 67.9,46.5 68.6,47.2 v68.6,49.5 | U3.11 41.2,25 41.2,21.4 42.1,20.5 45.6,20.5 51.38,26.29 53.38,26.29 54.45,27.35 54.45,30.16 v54.27,30.34
N$3  (via drill 0.35, 0.4)
  Top 0.152: D57.- 76.41,50 82.5,50 82.52,49.98 82.84,49.98 83.2,49.62 83.2,30.5 arc-70 82.5,29.5 arc5 81.3,29 arc-22 80.1,28.7 arc-6 78.9,28.7 arc68 78.4,28.4 arc-5 v77.97,27.57 | v50.48,26.47 50.48,26.82 50.47,26.83 50.47,27.63 51.48,28.64 54.13,28.64 54.44,28.34 65.23,28.34 v65.37,28.48 v65.38,28.48
  Bottom 0.152: U3.10 41.7,25 41.7,24.12 41.65,24.07 41.65,21.81 42.53,20.93 44.13,20.93 44.17,20.9 44.67,20.9 50.24,26.47 v50.48,26.47 | v65.38,28.48 65.38,30.21 arc28 65.2,30.9 arc-110 65.7,31.9 arc-13 68.87,32 arc45 69.09,32.09 70,33 75,33 78,30 78,28.26 77.97,28.23 v77.97,27.57
N$4  (via drill 0.4)
  Top 0.152: v73,46.2 D55.+
  Bottom 0.152: v73,46.2 R10.1
N$5  (via drill 0.4)
  Top 0.152: v68.9,46.5 70,47.6 D56.+
  Bottom 0.152: R11.1 70,47.6 v68.9,46.5
N$6  (via drill 0.4)
  Top 0.152: v74.9,46.6 76,47.7 D57.+
  Bottom 0.152: R12.1 75.02,46.6 v74.9,46.6
N$7  (via drill 0.35)
  Top 0.152: v39,27.2 41,25.2 41,24.53 v40.24,23.77 | v42.67,19.54 43.21,19 43.21,17.35 44.06,16.5 44.56,16.5 45.55,17.49 47.68,17.49 arc-45 48.13,17.3 48.31,17.12 arc-45 48.6,16.41 48.6,9.86 48.61,9.85 48.61,8.81 46.89,7.09 38.1,7.09 v38,6.99
  Bottom 0.152: IC2.12 8.63,9.13 15.34,2.42 arc45 16.13,2.1 25.04,2.1 25.5,1.63 26.3,1.63 26.76,2.1 27.93,2.1 arc45 28.64,2.39 33.51,7.26 arc-45 33.95,7.44 34.6,7.44 34.75,7.29 35.25,7.29 35.81,7.85 35.81,8.95 35.76,9 35.76,11.26 35.92,11.42 36.81,11.42 36.98,11.26 36.98,10.79 IC1.12 38,9.76 v38,6.99 | v42.67,19.54 42.42,19.79 41.8,19.79 40.49,21.11 40.49,23.52 v40.24,23.77 | U3.16 39.05,27.25 v39,27.2
N$10  (via drill 0.35)
  Top 0.152: v44.31,17.11 44.31,17.45 44.06,17.7 44.06,21.15 v44.42,21.5 | v45.67,26.27 42.17,29.77 41.19,29.77 40.82,30.14 40.82,30.66 41.19,31.03 42.11,31.03 42.91,30.23 43.65,30.23 v43.72,30.16
  Bottom 0.152: v45.67,26.27 45.7,26.27 45.81,26.16 45.81,22.9 v44.42,21.5 | v44.31,17.11 43.86,16.66 43.86,9 38.7,3.84 TP2.TP | U3.23 42.75,29.64 43.31,30.2 43.68,30.2 v43.72,30.16
N$11  (via drill 0.35)
  Top 0.152: 33.33,45.07 33.33,37.81 33.53,37.61 33.53,24.89 v33.57,24.85
  Top 0.254: v33.9,45.64 33.33,45.07
  Bottom 0.152: IC1.15 33.83,14.53 33.22,15.14 33.22,17.41 33.66,17.85 33.66,23.29 34.07,23.71 34.07,24.23 33.57,24.74 v33.57,24.85
  Bottom 0.254: R1.1 34.95,46.7 v33.9,45.65 v33.9,45.64
N$13  (via drill 0.35, 0.4)
  Top 0.152: v33.44,23.97 33.14,23.97 32.5,24.61 32.5,38.72 32.87,39.08 32.87,39.59 32.65,39.8 v32.65,40.15
  Bottom 0.152: 34.84,41.75 33.82,40.72 33.22,40.72 v32.65,40.15 | v33.44,23.97 33.26,23.79 33.26,22.75 33.11,22.6 33.11,22.25
  Bottom 0.254: R2.1 34.84,41.75 | IC1.1 32.55,20.43 33.25,21.12 33.25,21.67 33.11,21.8 33.11,22.25
N$14  (via drill 0.35)
  Top 0.152: 34.43,35.43 34.43,24.56
  Top 0.254: v34.5,35.5 34.43,35.43 | 34.43,24.56 v34.6,24.56
  Bottom 0.152: IC1.2 34.48,16.93 34.48,24.2
  Bottom 0.254: v34.5,35.5 34.5,36.55 R3.1 | 34.48,24.2 34.48,24.45 v34.6,24.56
N$16  (via drill 0.35)
  Top 0.152: 35.28,28.19 35.28,29.78 35.57,30.07 | 35.34,28.13 35.34,24.51 v35.46,24.39
  Top 0.254: 35.28,28.19 35.34,28.13 | v35.57,30.56 35.57,30.07
  Bottom 0.152: IC1.3 35.34,16.52 35.34,24.28 v35.46,24.39
  Bottom 0.254: R4.1 35.5,31.45 35.5,30.64 v35.57,30.56
N$17
  Bottom 0.152: IC1.4 36.37,23.59 arc-45 36.66,24.29 36.98,24.61 arc90 36.98,26.02 36.29,26.71 arc45 35.59,27 R5.1
N$18  (via drill 0.35)
  Top 0.152: FILTER_SW.1 78.1,47.89 arc-45 77.81,47.18 76.49,45.86 arc-45 74.16,44.9 69.89,44.9 v69.54,45.24 | v46.51,24.17 46.3,24.17 46.19,24.07 44.9,24.07 44.65,23.82 v42.26,23.82 | v46.5,25.38 46.61,25.49 47.45,25.49 49.41,27.45 49.41,28.4 48.7,29.11 48.7,30.55 48.97,30.82 48.97,32.27 49.62,32.91 52.94,32.91 53.68,32.18 53.68,30.91 53.64,30.87 53.64,30.08 54.01,29.71 55.42,29.71 55.73,29.4 56.23,29.4 56.58,29.76 56.58,30.27 56.44,30.41 56.44,42.24 arc-45 56.74,42.95 58.45,44.66 v58.71,44.66
  Bottom 0.152: U3.9 v42.25,23.82 v42.26,23.82 | v69.54,45.24 69.2,44.9 58.95,44.9 v58.71,44.66 | v46.5,25.38 v46.51,25.38 v46.51,24.17
N$67
  Bottom 0.152: IC1.5 37.74,16.38 37.74,19.84 38.47,20.57 39.29,20.57 39.64,20.21 39.64,20.14 40.86,18.93 42.92,18.93 43.28,19.29 45.09,19.29 51.74,25.93 53.53,25.93 55.37,27.77 55.37,30.26 55.73,30.61 55.96,30.61 56.34,30.99 56.34,31.39 R6.1
N$68
  Bottom 0.152: IC1.6 39.56,15.62 39.56,15.14 39.73,14.98 41.89,14.98 43.14,16.23 43.14,17.65 43.57,18.07 45.08,18.07 45.44,18.43 45.44,18.51 51.85,24.92 54.24,24.92 54.77,25.45 57.77,25.45 R7.1
N$69  (via drill 0.35)
  Top 0.152: v50,15 49.6,15.4 arc-45 49.3,16.11 49.3,17.71 arc45 49.01,18.42 arc45 48.34,18.7 44.84,18.7 v44.83,18.68
  Bottom 0.152: R8.1 54.83,9.05 arc-45 54.27,9.28 arc-45 53.98,9.99 53.98,10.19 arc45 53.39,11.61 v50,15 | IC1.7 40.84,16.93 40.84,17.41 42,18.57 43.07,18.57 43.17,18.68 v44.83,18.68
N$70  (via drill 0.35, 0.4)
  Top 0.152: v40.22,33.98 41,34.76 41,41 41.94,41.94 v42.04,41.94 | v59.77,48.31 59.77,48.9 59.4,49.27 arc45 58.95,49.46 57.38,49.46 56.84,50 44,50 v44,49.89 44.4,49.49 44.4,47.8 44,47.4 v41.45,47.4
  Bottom 0.152: v41.45,47.4 41.45,42.55 42.04,41.96 v42.04,41.94 | U3.22 42.25,29.36 42.19,29.41 42.19,30.55 41.65,31.09 41.11,31.09 40.27,31.93 40.27,33.92 v40.22,33.98 | R9.1 63.44,48.31 v59.77,48.31
N$72  (via drill 0.35)
  Top 0.152: PWR_SW.2 79,4 v77,4 | v36.2,25 36.28,25.08 39.38,25.08 39.41,25.1 v40.1,25.1 | v32.17,3.83 30,6 29.92,6 v29.79,6.12 | v68,1 66.55,1 v66.09,1.46
  Bottom 0.152: v68,1 74,1 v77,4 | v40.1,25.1 40.05,25.15 U3.13 | v32.17,3.83 34.27,1.73 arc45 35.44,1.24 65.88,1.24 v66.09,1.46 | v29.79,6.12 29.79,6.06 29.73,6 arc-45 28.74,8.4 28.74,8.82 28.7,8.86 28.7,19.76 31.7,22.75 31.7,23.84 33.31,25.46 34.56,25.46 35.02,25 v36.2,25
N$73  (via drill 0.35)
  Top 0.152: v48.8,20.8 48.8,21.16 47.11,22.85 47.11,24.42 46.76,24.77 45.8,24.77 41.66,28.92 39.81,28.92 39.46,29.28 39.46,29.5 v39.21,29.75
  Bottom 0.152: IC2.13 7.37,9.23 14.5,2.09 arc45 15.46,1.7 24.94,1.7 25.35,1.28 26.45,1.28 26.86,1.7 27.96,1.7 arc45 29.18,2.2 33.31,6.33 34.13,6.33 arc45 34.84,6.62 35.16,6.94 35.4,6.94 36.37,7.9 IC1.13 36.37,7.77 37.75,6.39 38.25,6.39 39.52,7.65 39.52,11.26 39.46,11.31 39.46,12 42.46,15 43,15 43.5,15.5 43.5,17.5 43.72,17.72 45.23,17.72 45.79,18.28 45.79,18.36 47.86,20.43 48.43,20.43 v48.8,20.8 | U3.19 40.34,28.95 40.32,28.92 39.81,28.92 39.46,29.28 39.46,29.5 v39.21,29.75
N$97  (via drill 0.35)
  Top 0.152: SW2.1 SW3.1 SW4.1 1.29,26.19 arc45 1,25.49 1,23.41 arc45 1.29,22.71 1.71,22.29 arc45 2.41,22 SW5.1 5.86,19.24 arc45 7.05,18.75 38.89,18.75 39.69,19.54 39.69,20.69 40.07,21.08 42.81,21.08 43.41,21.69 v43.45,21.69
  Top 0.254: SW2.1 SW1.1
  Bottom 0.152: v43.45,21.69 43.36,21.69 43.25,21.8 U3.7
N$98  (via drill 0.35)
  Top 0.152: SW6.1 SW7.1 SW8.1 SW9.1 9.1,26.69 arc-45 8.81,25.99 8.53,25.71 arc90 8.53,24.29 8.81,24.01 arc-45 9.1,23.31 SW10.1 11.85,19.25 38.9,19.25 39.33,19.68 39.33,20.84 39.92,21.43 42.3,21.43 v42.59,21.72
  Bottom 0.152: U3.8 42.75,24.41 42.86,24.3 42.86,23.56 42.59,23.29 v42.59,21.72
N$99  (via drill 0.35)
  Top 0.152: SW14.1 SW15.1 | SW14.1 SW13.1 SW12.1 SW11.1 | v15.75,29.09 15.1,28.44 SW14.1
  Bottom 0.152: U3.17 39.44,27.75 37.59,29.6 34.24,29.6 33.44,28.79 21.55,28.79 21.25,29.09 v15.75,29.09
N$100  (via drill 0.35)
  Top 0.152: SW16.1 SW17.1 SW18.1 21.1,29 21.5,29.4 v21.8,29.4 | SW19.1 SW20.1
  Top 0.254: 21.1,29 SW19.1
  Bottom 0.152: v21.8,29.4 21.9,29.3 33.43,29.3 34.08,29.95 38.14,29.95 39.53,28.57 39.73,28.57 U3.18
N$101  (via drill 0.35)
  Top 0.152: SW24.1 SW25.1 | SW24.1 SW23.1 SW22.1 SW21.1 | SW24.1 v28,28 | v38,27.47 38,27.5 38.6,28.1 38.6,30 38.95,30.36 39.46,30.36 40.06,29.75 v40.06,29.53
  Bottom 0.152: U3.20 41.25,29.36 40.98,29.63 40.17,29.63 v40.06,29.53 | v38,27.47 37.71,27.75 37.71,28.55 37.02,29.24 34.39,29.24 33.18,28.03 32.28,28.03 32.26,28 v28,28
N$102  (via drill 0.35, 0.4)
  Top 0.152: v43.17,30.86 43.17,31.31 43.16,31.31 43.16,33.82 v43.15,33.83 | v32.26,39.34 32.01,39.59 32.01,43.49 v31,44.5
  Top 0.254: SW1.2 6.9,44.6 v7,44.5 | v13,44.5 12.9,44.6 SW6.2 | v19,44.5 18.9,44.6 SW11.2 | v25,44.5 24.9,44.6 SW16.2 | v31,44.5 30.9,44.6 SW21.2
  Bottom 0.152: v7,44.5 v13,44.5 v19,44.5 v25,44.5 v31,44.5 | v43.17,30.86 43.88,30.86 44.42,30.32 44.42,30.03 44.33,29.93 44.33,29.91 43.97,29.55 43.47,29.55 43.25,29.33 U3.24 | v43.15,33.83 42.92,33.83 37.5,39.24 32.35,39.24 v32.26,39.34
N$103  (via drill 0.35)
  Top 0.254: SW17.2 v24.9,38.62 | SW22.2 v30.9,38.62 | v6.9,38.62 SW2.2 | SW7.2 12.9,38.62 13,38.52 v13,38.38 | SW12.2 v18.9,38.38
  Bottom 0.152: v6.9,38.62 8.07,38.62 8.11,38.58 9,38.58 9.04,38.62 9.34,38.62 9.38,38.58 10.27,38.58 10.31,38.62 10.61,38.62 10.65,38.58 11.54,38.58 11.58,38.62 11.88,38.62 11.92,38.58 12.81,38.58 12.85,38.62 | 12.9,38.62 13.15,38.62 13.19,38.58 17.89,38.58 17.93,38.62 18.9,38.62 v24.9,38.62 v30.9,38.62 33.62,38.62 33.88,38.89 35.2,38.89 39.12,34.96 40.63,34.96 41.2,34.39 41.2,33.51 41.11,33.42 41.74,32.8 43.41,32.8 44.63,31.58 44.88,31.58 45.23,31.22 45.23,30.34 44.68,29.79 44.68,29.76 43.95,29.03 U3.1
  Bottom 0.254: 12.85,38.62 12.9,38.62 13,38.52 v13,38.38 | 18.9,38.62 v18.9,38.38
N$104  (via drill 0.35)
  Top 0.152: SW8.2 13,33.9 v13,32.43 | v45.3,29.54 44.62,30.21 v44.62,30.97
  Top 0.254: SW13.2 v18.9,32.63 | SW3.2 v6.9,32.62 | SW23.2 v30.9,32.62 | SW18.2 v24.9,32.63
  Bottom 0.152: v18.9,32.63 v24.9,32.63 | 24.91,32.62 v30.9,32.62 31.87,32.62 32.64,33.38 36.55,33.38 36.79,33.14 39.25,33.14 39.59,33.48 39.59,34.24 39.96,34.61 40.48,34.61 40.85,34.24 40.85,33.66 40.76,33.57 40.76,32.83 40.97,32.62 41.38,32.62 42.51,31.49 43.75,31.49 44.27,30.97 v44.62,30.97 | 8.11,32.43 v13,32.43 17.89,32.43 | 44,27.75 44.36,27.75 44.63,28.02 44.63,28.88 v45.3,29.54
  Bottom 0.254: U3.2 44,27.75 | v24.9,32.63 24.91,32.62 | v6.9,32.62 7.92,32.62 8.11,32.43 | v18.9,32.63 18.09,32.63 17.89,32.43
N$105  (via drill 0.35)
  Top 0.152: SW24.2 31.6,27.3 31.6,24.92 33.35,23.16 40.85,23.16 41.5,23.81 41.5,24.4 41.7,24.6 41.7,24.8 42.2,25.3 44.42,25.3 v44.59,25.13
  Top 0.254: SW9.2 v12.9,26.62 | v24.9,26.63 SW19.2 | SW14.2 v18.9,26.63 | SW24.2 v30.9,26.62 | v6.9,26.62 SW4.2
  Bottom 0.152: v12.9,26.62 v6.9,26.62 | v12.91,26.63 v18.9,26.63 v24.9,26.63 30.89,26.63 | U3.5 44.56,26.25 44.63,26.18 44.63,25.17 v44.59,25.13
  Bottom 0.254: v12.91,26.63 v12.9,26.62 | 30.89,26.63 v30.9,26.62
N$106  (via drill 0.35)
  Top 0.152: SW5.2 6.9,20.85 v7,20.75 | v13,20.75 12.9,20.85 12.9,21.65 | v19.25,20.75 18.9,21.1 SW15.2 | v45.16,23.46 45.01,23.46 44.24,22.68 42.19,22.68 42.16,22.65 32.7,22.65 32.66,22.7 v32.66,23 | SW20.2 24.9,21.1 v25,21 25.43,20.57 29.57,20.57 30.9,21.9 SW25.2 31.61,21.29 v31.79,21.29
  Top 0.254: 12.9,21.65 SW10.2
  Bottom 0.152: v7,20.75 v13,20.75 v19.25,20.75 24.75,20.75 v25,21 | v31.79,21.29 32.3,21.8 32.3,22.65 v32.66,23 | U3.6 43.95,24.63 45.12,23.46 v45.16,23.46
N$110
  Bottom 0.152: IC2.14 6.09,9.23 6.21,9.12 13.53,1.79 arc45 14.49,1.39 15.03,1.39 15.08,1.34 24.79,1.34 25.21,0.92 26.59,0.92 27.01,1.34 28.82,1.34 32.18,4.7 39.06,4.7 41.33,6.98 41.33,10.02 IC1.9
N$118  (via drill 0.35)
  Top 0.152: v35,7.9 35.3,7.6 46,7.6 48,9.6 48,15 46.85,16.15 43.55,16.15 42.25,17.45 42.25,18.49 v40.29,20.44
  Bottom 0.152: IC1.14 35.09,8 v35,7.9 | v40.29,20.44 40.29,20.8 39.63,21.46 39.63,23.52 39.22,23.93 39.22,25.83 39.64,26.25 U3.14
N$119  (via drill 0.35)
  Top 0.152: v39,21.48 39,21.01 38.98,20.99 38.98,20.21 v38.72,19.96
  Bottom 0.152: IC2.11 9.9,9.03 10.42,8.52 15.89,3.04 arc45 17.2,2.5 25.14,2.5 25.65,1.99 26.15,1.99 26.66,2.5 27.94,2.5 34.48,9.05 34.48,11.26 35.01,11.78 37.73,11.78 38.91,10.6 IC1.11 38.91,14.61 38.53,14.98 38.46,14.98 38.3,15.14 38.3,19.3 38.72,19.72 v38.72,19.96 | v39,21.48 39,23.65 38.86,23.79 38.86,25.98 39.64,26.75 U3.15
N$LC1  (via drill 0.35)
  Top 0.152: v50.25,31 50.11,31.14 D41.+ 49.32,31.21 49.32,30.68 49.05,30.4 49.05,29.25 49.76,28.54 49.76,27.11 49.52,26.86 49.52,21.18 arc7 51,19 arc63 51.8,18.7 arc-41 53.6,18.4 arc-40 54.1,17.8 D71.+ 61.05,19.44 61.23,19.44 62.9,21.11 D61.+ | 48.62,51.3 v48.62,51.44 | v48.62,51.44 | 48.62,51.3 48.53,51.3 47.01,52.82 arc45 45.59,53.41 5.41,53.41 arc90 4.11,52.11 D1.+ D2.+ D3.+ D4.+ D5.+ 3.46,25 arc90 v1.69,23.22 | D81.+ 63.64,51.17 arc45 63.19,51.36 57.7,51.36 57.65,51.41 57.15,51.41 57.05,51.3 48.62,51.3
  Bottom 0.152: v50.25,31 49,32.25 49,36 42,43 43.19,44.19 45.66,44.19 46.01,44.54 46.01,48.48 48.36,50.83 arc45 v48.62,51.44 | IC2.15 5,9.75 5,8.41 arc-135 3.29,7.71 2.04,8.96 arc-45 1.65,9.91 1.65,23.19 v1.69,23.22 | v48.62,51.44
N$LC2  (via drill 0.35, 0.4)
  Top 0.152: D10.+ D9.+ D8.+ D7.+ D6.+ 12.82,51.71 arc-45 13.53,52 46.77,52 v46.87,52.11 | 64.89,21.11 58.5,14.72 58.5,14 | D72.+ 58.5,14 | D62.+ 64.89,21.11 | 64.89,21.11 64.73,21.11 64.71,21.09 v63.86,21.94 | v64.31,27.31 64,27 v61.03,27 | D82.+ 54.07,13.89 54.94,13.02 57.52,13.02 58.5,14 | v58.51,40 D42.+ 59.11,38.91 57.03,36.83 57.03,33.78 v57.36,33.45
  Top 0.254: D10.+ v9,25
  Bottom 0.152: IC2.1 3.56,24 arc-90 4.55,25 v9,25 | v46.87,52.11 46.91,52.14 51.61,52.14 57.09,46.66 57.09,44.69 58.51,43.28 v58.51,40 | v57.36,33.45 57.36,33.38 58.62,32.12 58.62,29.87 61.03,27.47 v61.03,27 | v64.31,27.31 64.64,26.97 64.64,26.41 65.22,25.84 65.22,24.74 63.86,23.39 v63.86,21.94
N$LC3  (via drill 0.35)
  Top 0.152: v17,22 16.11,22.89 D15.+ 16.11,28.59 16.36,28.84 16.36,29.34 16.11,29.59 D14.+ D13.+ D12.+ D11.+ 18.32,51.21 arc-45 19.02,51.5 47.09,51.5 arc-45 47.79,51.21 47.91,51.09 arc45 48.63,50.79 v57.39,50.79 v57.4,50.8 | v66.07,21.81 66.77,21.11 D63.+ 67,19.77 61.5,14.27 D73.+ 62.39,13 71.14,13 71.6,12.54 72.36,12.54 72.81,13 81,13 82,14 82,20.11 D83.+ | v59.34,37.77 59.11,37.55 D43.+ 59.11,35.51 arc45 59.4,34.8 59.49,34.71 arc-45 59.88,33.77 59.88,31.42 60.24,31.06 60.24,30.54 59.76,30.05 v58,30.05 | v63.45,24.95 63.81,24.95 64.76,24 v65.34,24
  Bottom 0.152: 5,16.25 5,21 arc-90 6,22 v17,22 | v57.4,50.8 57.7,50.51 57.7,44.59 59.11,43.17 59.11,38 v59.34,37.77 | v58,30.05 58,29.15 60.72,26.43 60.72,25.96 61.55,25.12 62.63,25.12 62.75,25.23 63.25,25.23 63.45,25.03 v63.45,24.95 | v65.34,24 65.59,23.75 65.59,23.6 66.07,23.11 v66.07,21.81
  Bottom 0.254: IC2.2 5,16.25
N$LC4  (via drill 0.35, 0.4)
  Top 0.152: 22.11,20.11 D20.+ 22.11,25.1 22.6,25.59 22.6,29.9 22.11,30.39 D19.+ D18.+ D17.+ D16.+ 23.37,50.26 arc-45 23.93,50.49 48.23,50.49 48.29,50.44 56.9,50.44 57.15,50.19 57.65,50.19 57.7,50.24 61.19,50.24 arc-45 61.64,50.06 61.78,49.92 arc-45 61.96,49.47 61.96,48.44 arc-45 61.78,47.99 arc61 61,45 arc-16 61.3,42.9 arc-10 61.2,41.6 arc-80 60.5,41 arc98 59.9,40.3 arc-19 59.88,39.55 arc-45 59.49,38.6 59.27,38.38 59.09,38.38 58.73,38.03 58.73,37.84 | v68.12,21.83 68.84,21.11 D64.+ D74.+ | 58.73,37.84 arc45 58.44,37.14 58.44,36.74 58.39,36.69 58.39,32.72 D44.+ 59.11,31.3 v59.61,30.8 | D84.+ 51.53,21.11 v51.81,21.39 | 58.73,37.84 | v64.23,25.43 65.24,25.43 66.19,24.47 v66.19,23.85
  Top 0.254: 22.11,20.11 v22,20
  Bottom 0.152: 6,17 6,18.48 arc-45 6.29,19.18 6.96,19.85 arc-45 7.67,20.14 21.65,20.14 arc-45 v22,20 | v59.61,30.8 61.64,28.78 61.64,26.34 61.63,26.34 61.63,25.83 61.98,25.48 62.49,25.48 62.91,25.9 64.15,25.9 64.42,25.62 | v51.81,21.39 54.1,23.68 54.1,24.17 55.03,25.1 56.15,25.1 56.84,24.41 56.84,24.37 57.4,23.8 63.16,23.8 64.42,25.07 64.42,25.62 | 64.42,25.62 v64.23,25.43 | v66.19,23.85 68.12,21.92 v68.12,21.83
  Bottom 0.254: IC2.3 6.09,16.91 6,17
N$LC5  (via drill 0.35, 0.4)
  Top 0.152: D21.+ D22.+ D23.+ D24.+ 28.11,28.75 28.61,28.25 28.61,27.75 28.11,27.25 D25.+ 28.11,23.3 arc45 28.4,22.6 v29,22 30.13,23.13 30.41,23.13 30.56,23.28 31.84,23.28 32.01,23.12 32.01,22.79 32.51,22.29 42.3,22.29 42.34,22.33 45.53,22.33 48.03,19.83 v48.12,19.83 | D85.+ 53,21 v54,20 | D75.+ 67.2,14.19 67.2,15.5 v67.4,15.7 67.5,15.8 67.5,17.48 arc-45 67.59,17.7 D65.+ 70.44,21.11 v70.17,21.39 | D45.+ 63.11,38.91 arc-45 62.92,38.46 62.36,37.9 arc45 62.07,37.19 62.07,35.07 v62.09,35.05
  Bottom 0.152: 7.25,16.75 9.6,19.1 arc-45 10.31,19.39 25.98,19.39 arc45 26.69,19.69 v29,22 | v67.4,15.7 65.7,17.4 arc45 64.99,17.7 57.29,17.7 arc-45 56.58,17.99 54.86,19.71 arc45 54.16,20 v54,20 53.4,19.4 48.54,19.4 v48.12,19.83 | v62.09,35.05 62.13,35.01 62.79,35.01 63,34.8 63.92,33.89 63.92,28.86 65.7,27.07 65.7,25.2 69.2,21.7 69.72,21.7 69.78,21.64 69.91,21.64 v70.17,21.39
  Bottom 0.254: IC2.4 7.37,16.64 7.25,16.75
N$LC6  (via drill 0.35)
  Top 0.152: D29.+ D28.+ D27.+ 38.11,41.25 38.61,41.75 38.61,42.25 38.11,42.75 D26.+ 38.48,44 39.39,43.09 40.38,43.09 41.3,44 D30.+ 42.11,44.49 43.49,45.86 arc-45 45.02,46.5 v53.19,46.5 | D86.+ 56,20.11 56,20.07 v56.04,20.04 | D66.+ 73,20.74 72.37,20.11 arc-45 71.67,19.82 71.43,19.82 arc45 70.73,19.53 v69.3,18.1 69.4,18 70.8,18 71,17.8 71,14.1 70.79,13.89 D76.+ | v37.11,28.3 37.89,29.08 37.89,31.78 37.94,31.83 | v63.2,37.37 63.2,36.09 D46.+ 63.1,35.25 arc-44 62.92,34.82 62,33.9 v62,33.81 | v55.9,24.49 60.64,24.49 v62.24,26.08
  Top 0.254: D29.+ 37.94,31.83
  Bottom 0.152: v69.3,18.1 69.16,18.24 arc45 68.45,18.53 57.88,18.53 arc-45 57.17,18.83 56,20 | v53.19,46.5 53.25,46.44 53.25,41.84 57.92,37.17 63,37.17 v63.2,37.37 | IC2.5 8.63,16.92 arc-45 8.93,17.63 9.99,18.69 arc-45 10.7,18.99 26.68,18.99 arc45 27.39,19.28 31.34,23.23 31.34,23.99 33.33,25.97 33.82,25.97 34.02,26.18 34.02,27.87 34.18,28.03 36.84,28.03 v37.11,28.3 | v62,33.81 61.62,33.81 61.62,29.29 61.99,28.92 61.99,26.33 v62.24,26.08 | 56,20 56,23.49 55.88,23.61 55.88,24.11 55.9,24.14 v55.9,24.49 | 56,20 v56.04,20.04
N$LC7  (via drill 0.35)
  Top 0.152: D35.+ D34.+ 45.41,44.7 v45.41,44.79 | v58,20 58,20.11 D87.+ 57.87,21.11 v57.88,21.1 | D47.+ 63.11,33.59 v63.01,33.69 | D33.+ D32.+ D31.+ 42.48,40 43.39,40.91 44.38,40.91 45.3,40 D35.+ | v49.5,38.5 48.5,38.5 48.35,38.35 47.76,38.35 D35.+ | D77.+ arc-38 73.1,15.5 v73.3,17.82 D67.+
  Bottom 0.152: IC2.6 9.9,14.4 9.25,13.75 3.06,13.75 arc-90 2.06,14.75 2.06,22.73 2.31,22.98 2.31,52 arc-90 3.31,53 37.2,53 v45.41,44.79 | 63,34 63.01,33.99 v63.01,33.69 | v58,20 58,19.6 arc90 58.2,19.4 60.07,19.4 60.1,19.43 71.69,19.43 arc-90 v73.3,17.82 | v49.5,38.5 51.05,38.5 55.13,34.42 60.54,34.42 60.54,34.41 62.59,34.41 63,34 | v57.88,21.1 58.28,21.49 60.23,21.49 62.18,23.44 63.3,23.44 64.86,25 64.86,25.69 63,27.55 63,34
N$LC8  (via drill 0.35)
  Top 0.152: D38.+ D39.+ | D39.+ D40.+ 49.3,36 48.38,36.91 47.39,36.91 46.48,36 D36.+ D37.+ 46.11,30.89 v46.89,30.11 | D78.+ v76.5,17 76.5,20.61 D68.+ | D48.+ 67,39.89 v67,38 | v51,41 50.11,40.11 D39.+ | v50.14,29.02 50.14,27.8 50.12,27.77 50.12,26.96 49.87,26.72 49.87,22.61 50.46,22.02 59,22.02 D88.+ v59,20.01 | v25.9,2.6 25.9,1.95 v24.61,0.66
  Bottom 0.152: v67,38 65.29,38 64.05,36.76 61.49,36.76 61.44,36.81 57.77,36.81 53.59,41 v51,41 | v46.89,30.11 47,30 48.43,30 49.12,29.31 49.2,29.31 49.48,29.02 v50.14,29.02 | IC2.7 11.18,15.43 arc90 13.6,13 16.18,13 arc-45 16.9,12.7 25.59,4.01 arc-45 25.9,3.26 arc-45 v25.9,2.6 | v59,20.01 59,19.87 59.08,19.78 73.72,19.78 v76.5,17 76.5,10.5 67.42,1.42 arc-45 66.01,0.83 27.01,0.83 26.74,0.57 25.06,0.57 24.97,0.66 v24.61,0.66
N$LC9  (via drill 0.35, 0.4)
  Top 0.152: D79.+ v79.5,17 79.5,20.61 D69.+ | D53.+ D54.+ 78.3,32 77.38,32.91 76.39,32.91 75.48,32 D52.+ D51.+ 71.6,36 arc-45 69.7,36.79 69.64,36.85 arc90 68.33,36.85 67.48,36 D49.+ D50.+ 67.48,32 68.39,32.91 69.38,32.91 69.61,32.69 69.61,31.31 69,30.7 67.2,30.7 arc45 66.49,30.41 66.43,30.35 66.43,28.95 arc-45 66.13,28.24 63.67,25.78 63.29,25.78 62.06,24.55 62.06,22.54 61,21.48 D89.+ | D89.+ 60.96,21.11 v59.97,22.1 | v41.45,30.4 42.23,30.4 44.79,27.85 v48.44,27.85 | v56.48,23.86 55.67,23.86 55.29,24.24 55.29,26.5 v53.76,28.03 v53.75,28.03 | D89.+ v61,20.39 | v59.97,22.1
  Bottom 0.152: v79.5,17 76.2,20.3 61.09,20.3 v61,20.39 | U3.21 41.75,30.1 v41.45,30.4 | v48.44,27.85 | v48.44,27.85 49.72,27.85 49.87,27.7 50.13,27.7 50.46,28.03 v53.75,28.03 | v56.48,23.86 58.16,22.19 59.88,22.19 v59.97,22.1
N$LR1  (via drill 0.35)
  Top 0.152: D36.- 47.89,35.11 v48,35 50.52,35 51.16,35.65 51.16,36.69 53.78,39.3 v53.88,39.3 | v44,39 43.89,39.11 D31.- | D49.- 68.89,34.86 v69,34.75 | v40.29,45.1 39.89,44.7 D26.- 39.52,44 37.02,46.5 v33,46.5
  Top 0.254: D1.- 6,48.89 v6,47.75 | v12,47.75 11.89,47.86 D6.- | v18,47.75 17.89,47.86 D11.- | v24,47.75 23.89,47.86 D16.- | v30,47.75 29.89,47.86 D21.-
  Bottom 0.152: v6,47.75 v12,47.75 v18,47.75 v24,47.75 v30,47.75 | v33,46.5 33,47.7 R1.2 | v48,35 v44,39 40.75,42.25 40.75,44.64 v40.29,45.1 | v53.88,39.3 54.05,39.3 56.89,36.46 61.3,36.46 61.35,36.41 63.2,36.41 64.85,34.75 v69,34.75
  Bottom 0.254: v30,47.75 R1.2
N$LR2  (via drill 0.35)
  Top 0.152: v30,41.75 29.89,41.86 D22.- | D27.- 40,39.89 v40,39 | v44,35 43.89,35.11 D32.- | D37.- 47.89,31.11 v47.83,31.05 | v49.66,30 52.71,30 53.72,29 54.62,29 54.92,28.69 56.52,28.69 56.92,29.09 64.66,29.09 66.63,31.06 67.61,31.06 68.55,32 D50.-
  Top 0.254: D2.- 6,42.89 v6,41.75 | v12,41.75 11.89,41.86 D7.- | v18,41.75 17.89,41.86 D12.- | v24,41.75 24,42.89 D17.-
  Bottom 0.152: v6,41.75 v12,41.75 v18,41.75 v24,41.75 v30,41.75 R2.2 33.16,41.75 34.33,42.93 36.07,42.93 v40,39 v44,35 48,31 | 48,31 48.98,30.02 49.4,30.02 49.42,30 v49.66,30 | 48,31 47.89,31 v47.83,31.05
N$LR3  (via drill 0.35)
  Top 0.152: D28.- 40,35.89 v40,35.57 40,35 39.96,34.96 39.81,34.96 39.23,34.39 39.23,34 v38.98,33.75 | D38.- 52,44.11 52.11,44.11 | v43.94,33.15 43.89,33.1 D33.- | 52.11,44.11 55.62,44.11 v58.31,46.8 | v40,42 40.9,42.9 42.8,42.9 43,43.1 43,44.6 44.16,45.76 50.47,45.76 52.11,44.11 | v38,42 34.28,38.28 v34.13,38.28 | v61.51,45.89 64,45 arc-16 71.8,40.9 D51.-
  Top 0.254: D3.- 6,36.89 v6,36 | v12,36 11.89,36.11 D8.- | v18,36 17.89,36.11 D13.- | v24,36 23.89,36.11 D18.- | v30,36 29.89,36.11 D23.-
  Bottom 0.152: v6,36 v12,36 v18,36 v24,36 v30,36 30.95,36.95 33,36.95 | 33,36.95 33,35 34.25,33.75 v38.98,33.75 | 33,36.95 R3.2 34.13,38.09 v34.13,38.28 | v38,42 v40,42 | v43.94,33.15 42.24,33.15 41.56,33.83 41.56,34.53 40.77,35.32 40.25,35.32 v40,35.57 | v58.31,46.8 58.37,46.74 58.37,45.64 58.74,45.27 59.26,45.27 59.89,45.89 v61.51,45.89
N$LR4  (via drill 0.35)
  Top 0.152: 48,44 D34.- | 51.94,40.06 52,40.11 52,41 51.16,41.84 51.16,44.35 50.61,44.91 49.62,44.91 48.7,44 48,44 | 51.94,40.06 D39.- | v52.97,39.59 52.41,39.59 51.94,40.06 | v39.09,31.32 39.21,31.32 D29.- 39.89,33.41 39.59,33.72 39.59,34.24 39.96,34.61 40.11,34.61 40.61,35.11 40.61,37.53 39.16,38.98 39.16,40.69 39.39,40.91 40.13,40.91 41.76,42.54 42.31,42.54 42.41,42.44 44.25,42.44 44.8,42.99 44.8,45.1 45.1,45.4 46.6,45.4 48,44 | v68.96,33.52 69.04,33.44 69.36,33.44 69.97,32.83 69.97,32.69 71.53,31.13 arc45 72.24,30.84 75.36,30.84 76.52,32 D52.-
  Top 0.254: D4.- 6,30.89 v6,29.75 | v12,29.75 11.89,29.86 D9.- | v18,29.75 17.89,29.86 D14.- | D19.- 23.89,30.02 v24,29.91 | v30,29.91 29.89,30.02 D24.-
  Bottom 0.152: v6,29.75 v12,29.75 v18,29.75 21.29,29.75 21.55,30.01 22.05,30.01 22.31,29.75 24,29.75 30,29.75 32.3,32.05 33.05,32.05 | 33.05,32.05 R4.2 | v39.09,31.32 38.11,31.32 36.4,33.03 34.03,33.03 33.05,32.05 | v52.97,39.59 53.26,39.3 53.26,36.78 54.3,35.75 61,35.75 61.05,35.7 62.83,35.7 65.07,33.46 68.89,33.46 v68.96,33.52
  Bottom 0.254: 24,29.75 v24,29.91 | 30,29.75 v30,29.91
N$LR5  (via drill 0.35)
  Top 0.152: D30.- 44,43.89 v44,43.05 | v48.1,38.96 47.89,39.17 D35.- | v35.89,28.64 36.83,27.69 37.36,27.69 38.24,28.57 38.24,30.15 38.81,30.71 39.74,30.71 41.04,29.41 41.67,29.41 45.42,25.66 45.92,25.66 46.28,26.02 46.28,26.16 47.36,27.24 48.69,27.24 49.05,27.59 49.05,28.25 48.34,28.96 48.34,30.7 48.61,30.97 48.61,32.41 49.47,33.27 50.27,33.27 v52,35 51.89,35.11 D40.- 52.83,36 v53.87,37.04 | v77,34 78.39,35.39 78.39,36.69 78.62,36.91 79.61,36.91 80.52,36 D53.-
  Top 0.254: D5.- 6,24.89 v6,23.75 | v12,23.75 11.89,23.86 D10.- | v18,23.75 17.89,23.86 D15.- | v24,23.75 23.89,23.86 D20.- | v30,23.75 29.89,23.86 D25.-
  Bottom 0.152: v6,23.75 v12,23.75 v18,23.75 v24,23.75 v30,23.75 33.05,26.8 R5.2 33.66,27.61 33.66,28.01 34.19,28.54 35.78,28.54 v35.89,28.64 | 48.1,38.9 44,43 v44,43.05 | 48.1,38.9 v52,35 | 48.1,38.9 v48.1,38.96 | v53.87,37.04 54.8,36.1 61.15,36.1 61.2,36.05 62.98,36.05 64.9,34.13 69.21,34.13 69.34,34 v77,34
N$LR6  (via drill 0.35)
  Top 0.152: D42.- v60.89,39 D43.- | D47.- D46.- v64.89,39 D45.- 65.7,40 66.62,40.91 67.61,40.91 68.52,40 D48.- | D47.- 63.89,31 61.89,31 60.94,31.95 | 60.94,31.95 D44.- | D41.- 52.16,31.73 v53.08,31.73 53.08,30.14 53.86,29.35 54.76,29.35 55.07,29.05 56.38,29.05 56.77,29.44 59.66,29.44 60.86,30.64 60.86,31.86 60.94,31.95 | D47.- 65.77,31.12 v65.84,31.12 | D54.- 80.89,31.41 arc-45 80.6,30.71 80.28,30.39 arc-45 79.57,30.1 67.11,30.1 v67.06,30.04
  Bottom 0.152: R6.2 54.78,31.73 v53.08,31.73 | v64.89,39 v60.89,39 | v65.84,31.12 66.87,30.1 67,30.1 v67.06,30.04
N$LR7  (via drill 0.35)
  Top 0.152: D69.- D68.- D67.- D66.- D65.- D64.- D63.- D62.- D61.- 63,24.19 v62.78,24.41
  Bottom 0.152: R7.2 60.73,24.63 62.56,24.63 v62.78,24.41
N$LR8  (via drill 0.35)
  Top 0.152: D79.- D78.- D77.- D76.- D75.- D74.- D73.- D72.- D71.- 54.89,11.5 v54.89,11.07
  Bottom 0.152: v54.89,11.07 55.88,11.07 R8.2
N$LR9  (via drill 0.35, 0.4)
  Top 0.152: 54,22.89 D85.- D84.- 52,23.89 v52,24 | 54,22.89 D86.- D87.- D88.- D89.- | v60.67,49.39 60.67,47.67 60.03,47.03 60.03,45.44 59.86,45.27 58.27,45.27 55.46,42.46 arc45 55.17,41.76 55.17,31.15 55.98,30.35 v55.98,30.01 | v65.7,50.3 66.29,50.3 D81.- 68.09,48.5 arc-90 68.09,47.09 arc90 68.09,45.71 70.11,43.69 arc45 70.81,43.4 76.39,43.4 arc-45 77.09,43.11 82.21,37.99 arc-45 82.5,37.29 82.5,30.7 81.4,29.6 arc-37 80.4,29.1 78.55,29.1 76,26.55 76,25.4 76.9,24.5 79.8,24.5 81,23.3 D83.- | 54,22.89 54,23.81 53.99,23.81 v53.99,25.53 | D82.- 51.88,12.73 arc-45 51.59,13.44 51.36,13.67 51.36,14.56 51.23,14.69 50.93,15.72 50.93,15.74 50.92,15.74 49.65,20.15 49.53,20.03 v49.46,20.03
  Bottom 0.152: v65.7,50.3 65.7,49.8 65.55,49.65 | R9.2 60.93,49.65 v60.67,49.39 | v52,24 49.7,21.7 49.7,20.27 v49.46,20.03 | v53.99,25.53 53.99,25.89 55.98,27.87 v55.98,30.01
  Bottom 0.254: 65.55,49.65 R9.2
VCC  (via drill 0.35, 0.4, 0.85)
  Top 0.152: v42,6 40.33,6 39.94,6.39 v39.89,6.39 v39.88,6.39 37.75,6.39 37.69,6.44 34.97,6.44 arc-45 34.26,6.74 v32.77,8.23 | v72,10 82,10 arc90 83.81,11.8 83.81,50 arc90 82.81,51 v78,51 | v54.73,23.91 54.73,25.65 52.97,27.41 v52.81,27.41 | v16,9 29.2,9 v29.31,9.11
  Bottom 0.152: v42,6 TP1.TP 45.95,3 48,5.05 48,6 50.07,8.07 70.07,8.07 arc90 v72,10 72,12.19 72.89,13.08 72.89,13.84 72,14.73 U$1.+$2 | 46.7,26.75 49.75,26.75 50.54,27.54 52.81,27.54 v52.81,27.41 | 46.7,26.75 C3.1 | v16,9 15.65,9.35 arc-45 15.06,10.76 C1.1 14.24,11.22 12,11.22 11.84,11.06 11.84,10.84 11.05,10.05 IC2.10 11.18,11.12 10.7,11.6 4,11.6 3.56,11.15 IC2.16 | IC1.10 40.17,6.72 39.89,6.44 v39.89,6.39 | R10.2 73.14,49.52 R12.2 77.52,51 v78,51 | R11.2 72.9,49.75 R10.2 | 46.7,26.75 46.55,26.75 46.22,27.08 45.42,27.08 45.09,26.75 U3.4 | v54.73,23.91 55.28,23.91 55.43,23.76 55.43,19.79 57.15,18.07 57.19,18.06 57.29,18.05 65.55,18.05 arc-67 v69.48,15.46 U$1.+$2 | v32.77,8.23 32.77,9.91 IC1.16 32.38,9.95 C2.1 29.56,9.11 v29.31,9.11 | R10.2 73,49.55 71.97,48.52 71.97,46.34 72.61,45.7 72.61,39.04 U$1.+$1 | U$1.+$1 v70.88,38.46 | U$1.+$2 v71.98,15.46 | U$1.+$2 v74.18,15.46 | U$1.+$1 v72.88,38.46

### Text on the board
Top: Paul Klinger | Data Scientist | paulklinger.com
bPlace: - | D | +
tValues: filter | ... | ( ) | = | ( ) | 8 | 4 | 2 | 1 | ( ) | ( ) | x4 | x8 | x16 | max | ... | ... | ( ) | 0 | 1 | 2 | 3 | 4 | 5 | 6 | 7 | 8 | 9
tStop: Paul Klinger | Data Scientist | paulklinger.com
bStop: v1.1 2020-11